# EAGLE design USB Host (EAGLE 5.04)
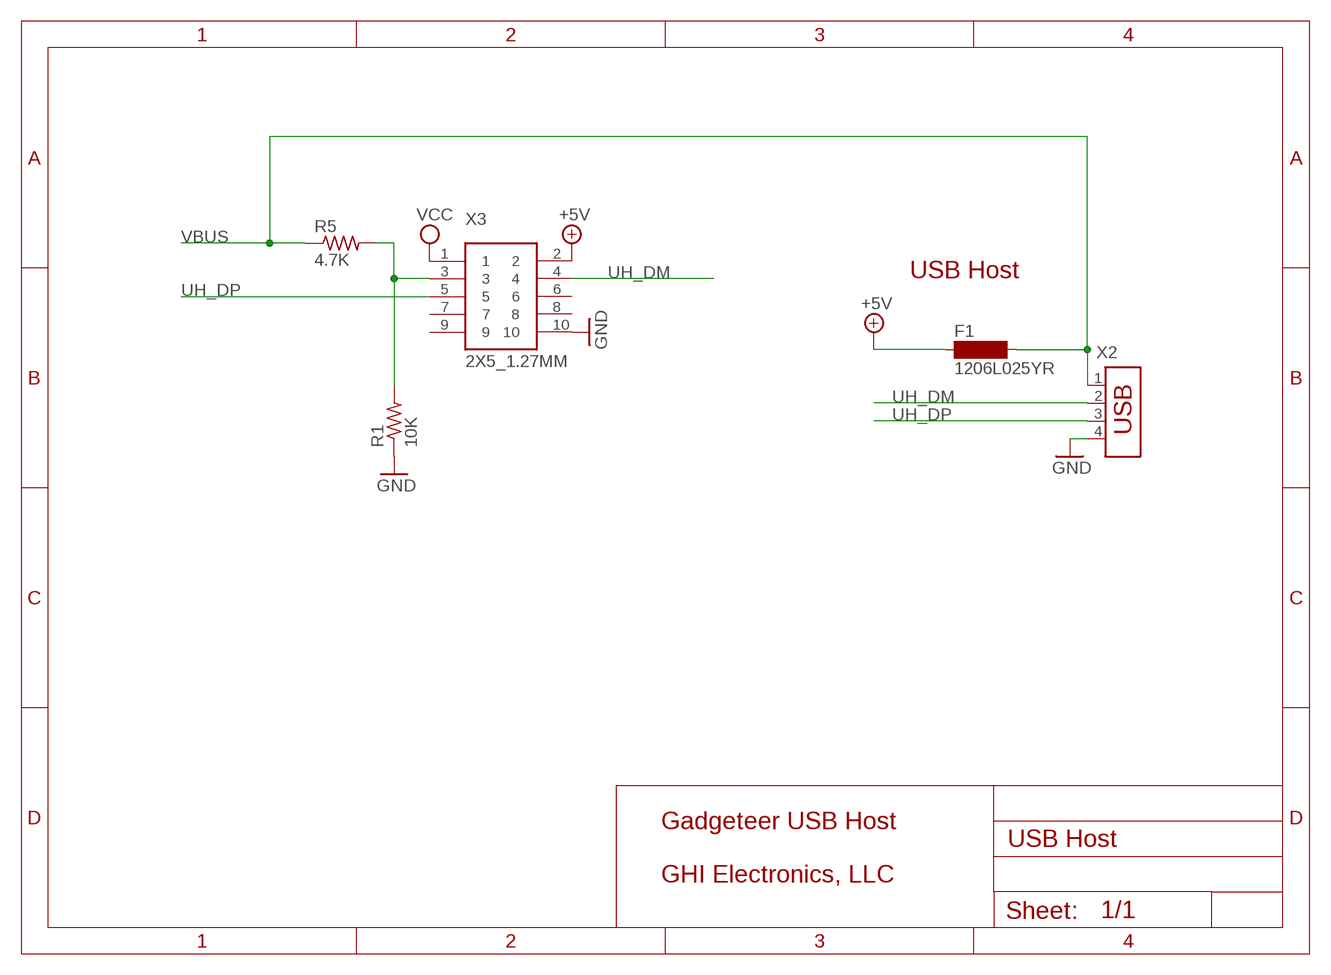
[diagram p0: schematic, sheet 1]

## Parts
F1  1206L025YR  SM-1206  [SM-1206]
R1  10K  R-US_R0603  [R0603]
R5  4.7K  R-US_R0603  [R0603]
X2  USB-787616  [USB]
X3  2X5_1.27MM  [2X5_1.27MM]

## Nets
+5V [power]: F1.1 X3.2
GND [power]: R1.1 X2.4 X3.10
N$1: R1.2 R5.2 X3.3
UH_DM: X2.2 X3.4
UH_DP: X2.3 X3.5
VBUS: F1.2 R5.1 X2.1
VCC [power]: X3.1
Unconnected: X3.6 X3.7 X3.8 X3.9

## Notes on the sheet
- USB Host
- Gadgeteer USB Host
- GHI Electronics, LLC

## Library data of the parts
F1 = inductor-neosid:SM-1206: INDUCTOR SMD chip inductor
R1 R5 = rcl:R-US_: RESISTOR, American symbol
X2 = con-amp:USB-787616: AMP connector
X3 = GHI:2X5_1.27MM

## Net classes
0 default: width 0.254 mm, drill 0.381 mm, clearance 0.203 mm

## Board
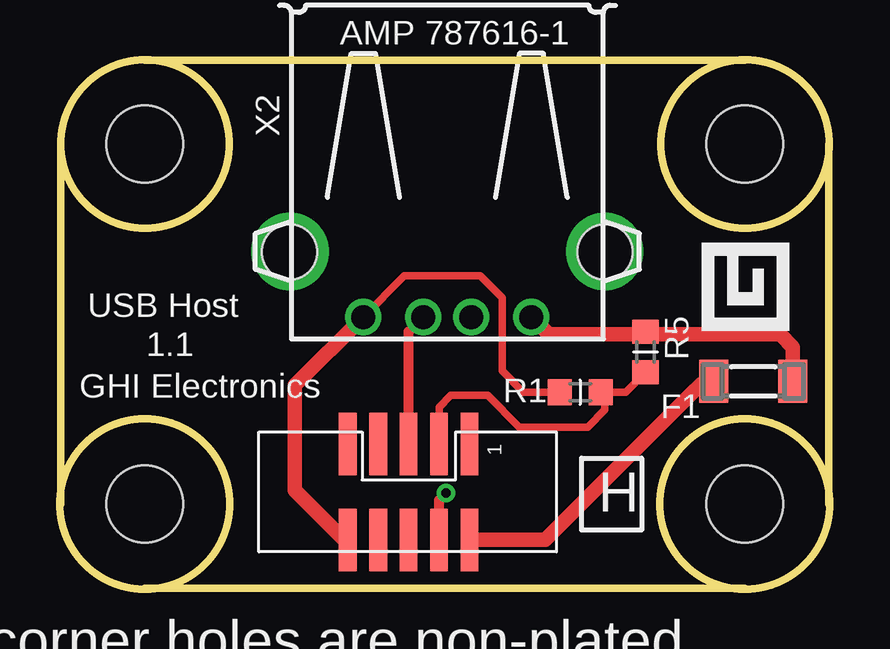
[diagram p1: board, top side]
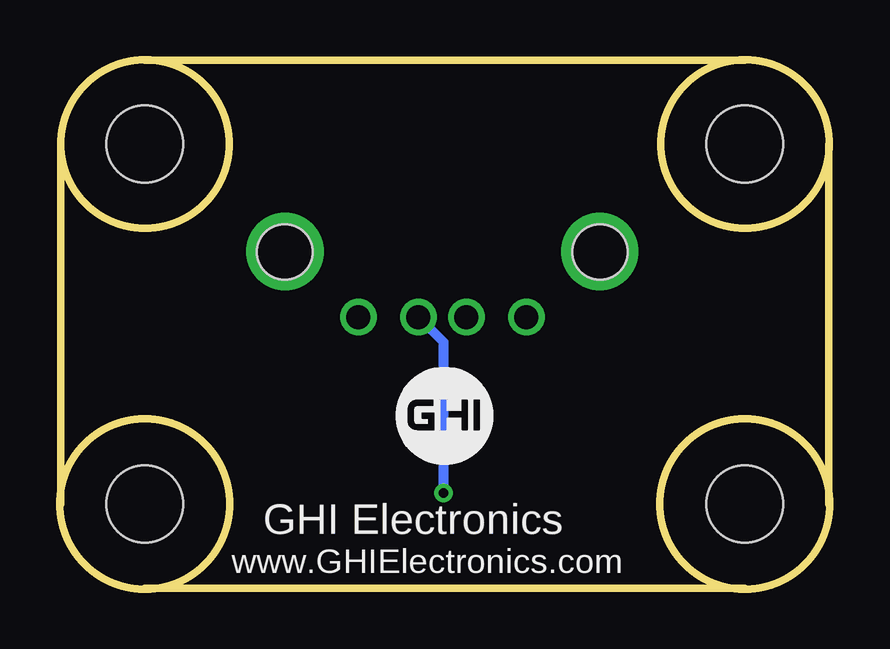
[diagram p2: board, bottom side, seen from below]

Size 32.07 x 22.04 mm. Coordinates in mm from the lower left corner, seen from the top.
Outline: 32.04,3.54 32.04,18.54
Outline: 0.04,18.54 0.04,3.54
Outline: 3.54,22.04 28.54,22.04
Outline: 28.54,0.04 3.54,0.04
Outline: circle at 3.54,18.54 radius 3.5
Outline: circle at 28.54,18.54 radius 3.5
Outline: circle at 28.54,3.54 radius 3.54
Outline: circle at 3.54,3.54 radius 3.54
Copper layers (1+16): Top 0.035mm / dielectric 1.5mm / Bottom 0.035mm
Design rules "default *": minimum track width 8mil, minimum drill 12mil, track to track 8mil, track to pad 8mil, pad to pad 8mil, via to via 8mil, smd to smd 8mil, copper to edge 15mil, drill to drill 8mil, minimum pad ring 10mil, minimum via ring 7mil, stop-mask expansion 4mil, vias tented up to drill 50mil, thermal gap 10mil
Holes 3.2 mm at 3.54,3.54 28.54,18.54 3.54,18.54 28.54,3.54

### Footprints (pad centres in the part's own frame; a part is rotated, then mirrored left to right if it is on the bottom)
SM-1206 = smd 1.2 x 1.8: 1 -1.65,0; 2 1.65,0
R0603 = smd 1 x 1.1: 1 -0.85,0; 2 0.85,0
USB = drill 1 round: 1 -3.5,12.99; 2 -1,12.99; 3 1,12.99; 4 3.5,12.99 | hole 2.3: -6.57,10.28; 6.57,10.28
2X5_1.27MM = smd 2.6 x 0.74: 1 -2,2.58; 2 2,2.58; 3 -2,1.31; 4 2,1.31; 5 -2,0.04; 6 2,0.04; 7 -2,-1.23; 8 2,-1.23; 9 -2,-2.5; 10 2,-2.5

### Placement (x,y rotation side)
F1  28.88,8.65 0 top
R1  21.68,8.19 0 top
R5  24.4,9.87 270 top
X2  16.14,24.32 180 top
X3  14.49,4.04 270 top

### Tracks (layer width: path | path; a pad name or v marks a point on that pad's centre or on a via)
+5V
  Top 0.61: X3.2 20.23,2.04 26.25,8.06 26.76,8.57 F1.1
GND
  Top 0.305: R1.1 19.31,8.19 18.43,9.08 18.43,12.13 17.51,13.04 14.35,13.04 X2.4
  Top 0.61: X3.10 11.85,2.04 9.79,4.1 9.79,8.48 X2.4
N$1
  Top 0.305: X3.3 15.8,7.57 16.29,8.06 17.82,8.06 19.14,6.74 21.98,6.74 22.69,7.45 22.69,8.02 R1.2 23.57,8.19 R5.2
N$2  (via drill 2.2)
  other vias: 9.59,14.06
N$3  (via drill 2.2)
  other vias: 22.69,14.06
UH_DM  (via drill 0.41)
  Top 0.406: X3.4 15.8,3.7 v16.09,4
  Bottom 0.406: v16.09,4 16.09,10.28 X2.2
UH_DP
  Top 0.406: X3.5 14.53,10.71 X2.3
VBUS
  Top 0.406: R5.1 24.2,10.61 21.88,10.6
  Top 0.61: F1.2 30.53,10.08 30.01,10.6 21.88,10.6 20.36,10.6 X2.1

### Text on the board
tPlace: USB Host | 1.1 | GHI Electronics | H | corner holes are non-plated | black PCB with white text | do not add manufacturing codes
bPlace: GHI Electronics | www.GHIElectronics.com